# EasyEDA schematic BIT 5.json
TITLE: TRICORE | ALU | CMP; REV: 1.0; Date: 2022-01-05; Sheet: 3/8; Drawn By: Koehler, Paul; Company: komed3
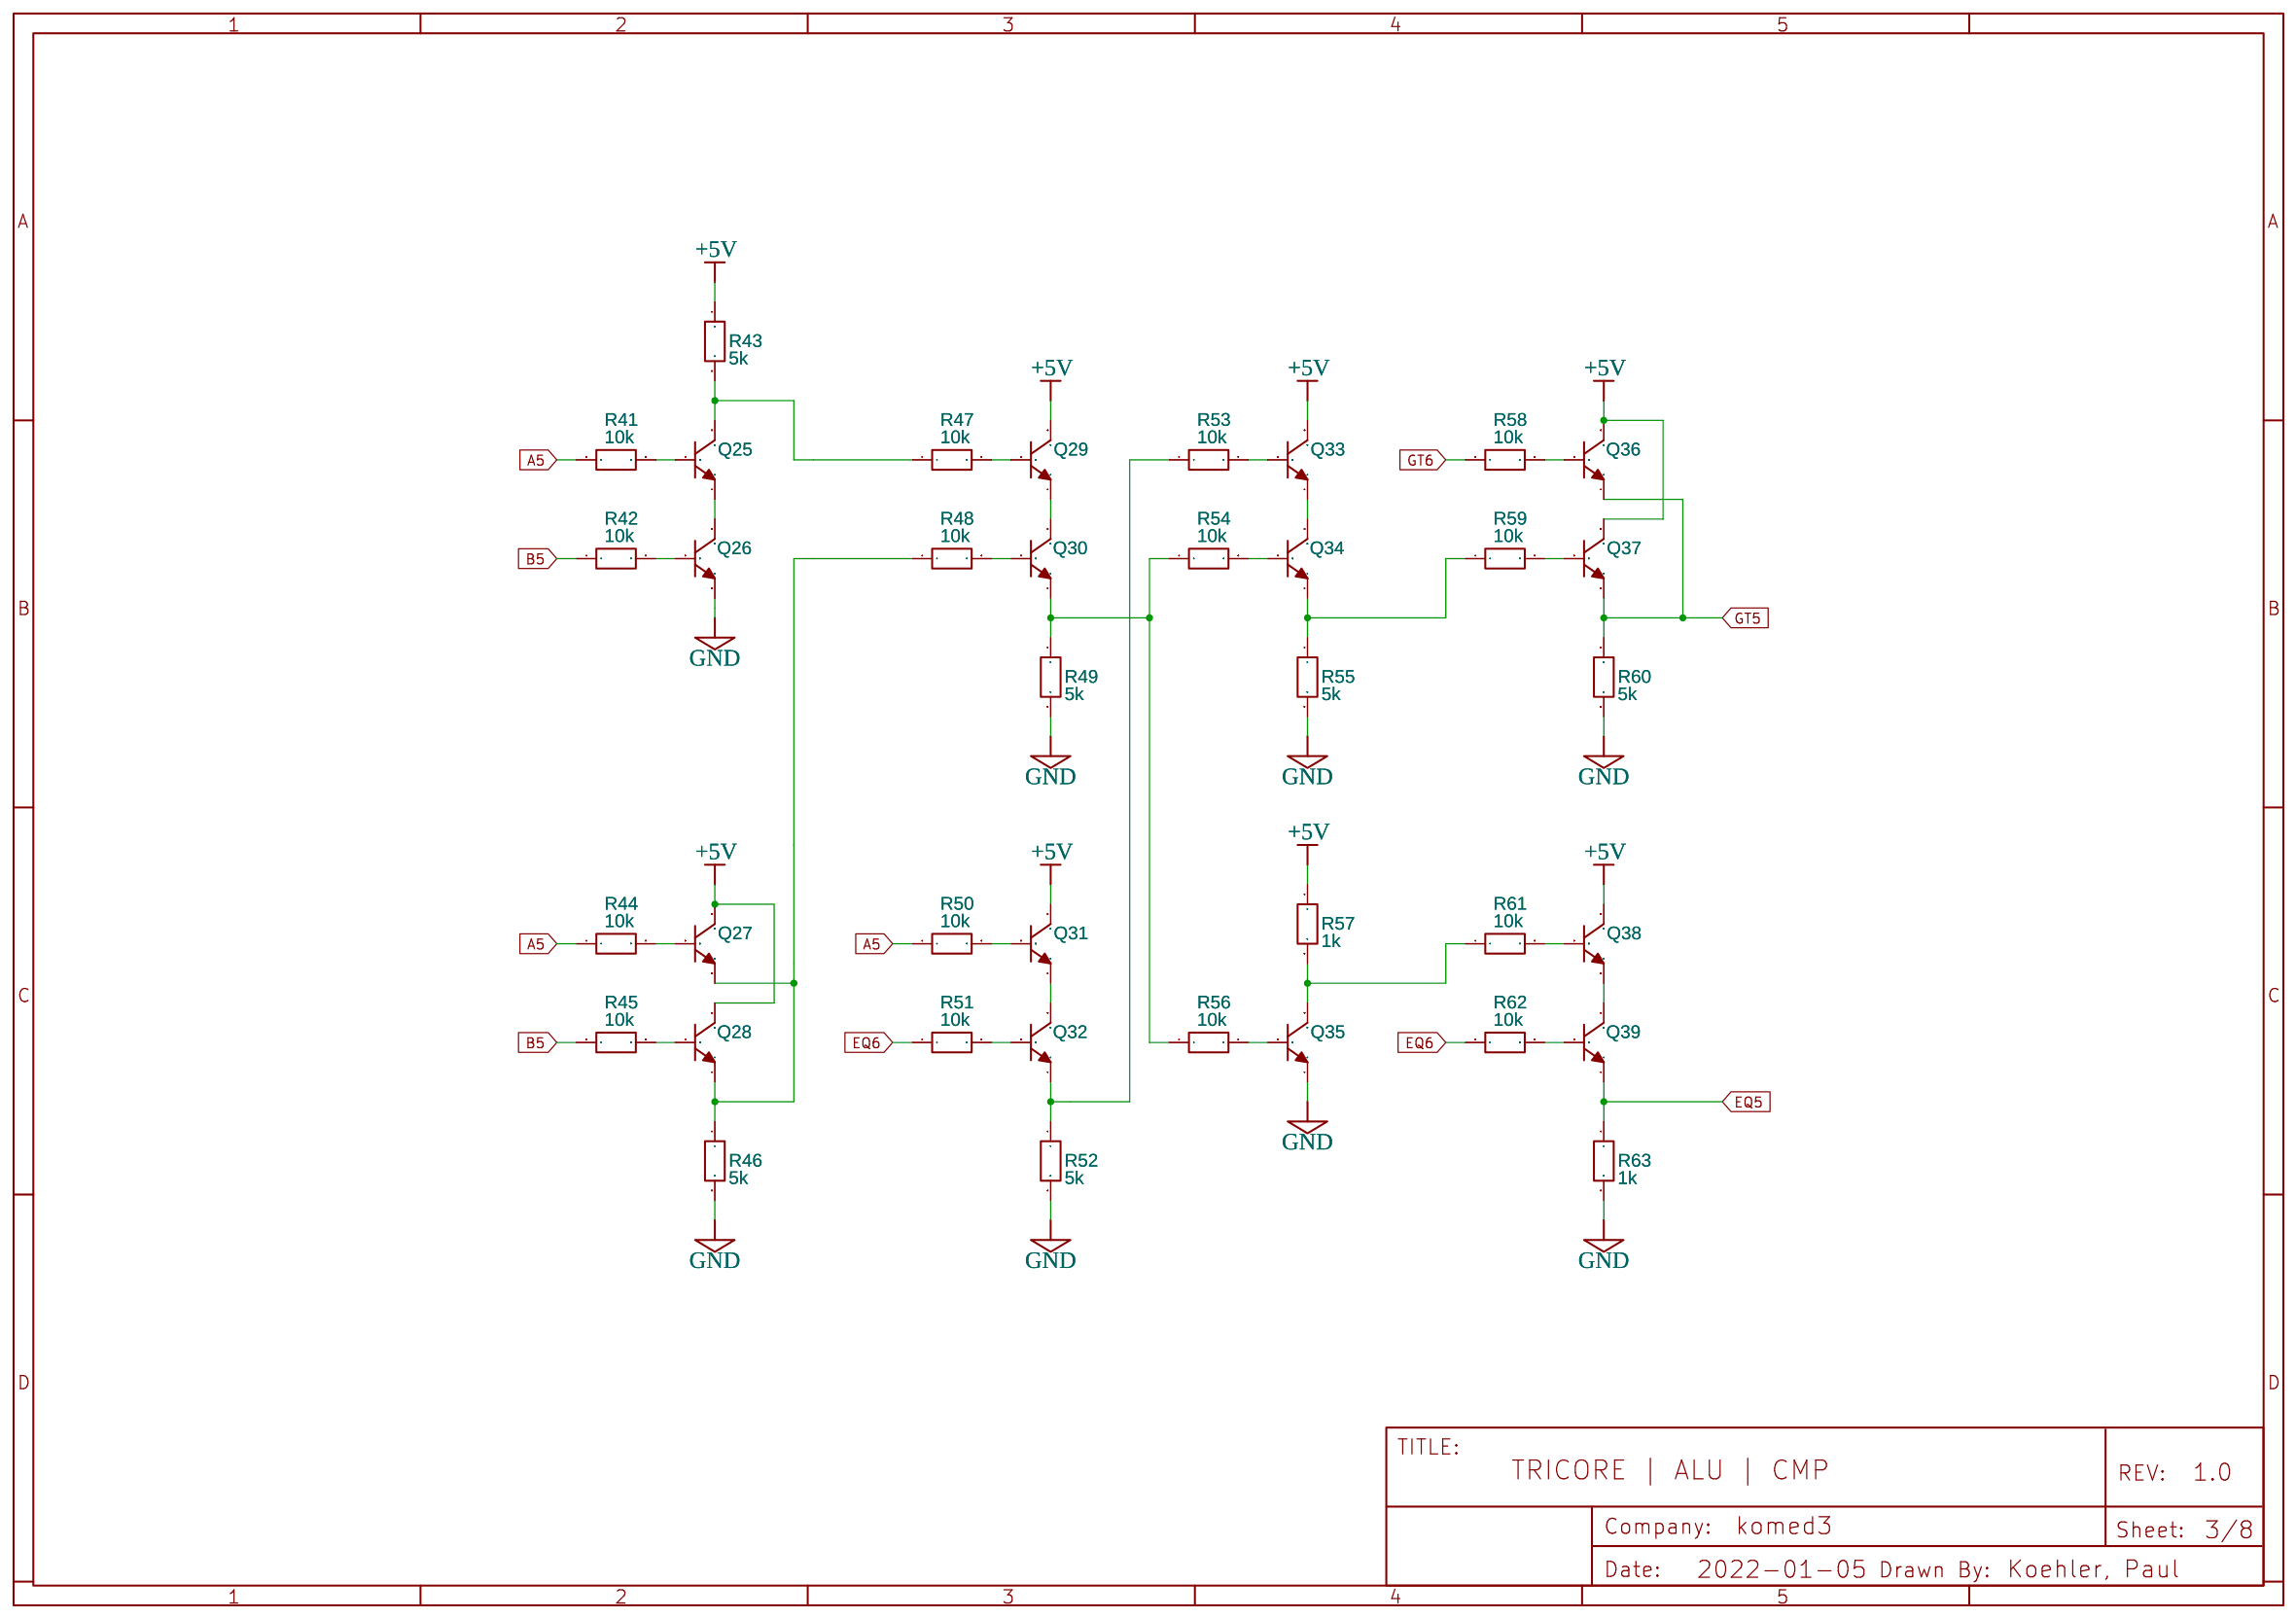
[diagram p0: schematic sheet]

## Parts
Q25  2N3904(TO-92)  [TO-92-3_L5.1-W4.1-P1.27-L]
Q26  2N3904(TO-92)  [TO-92-3_L5.1-W4.1-P1.27-L]
Q27  2N3904(TO-92)  [TO-92-3_L5.1-W4.1-P1.27-L]
Q28  2N3904(TO-92)  [TO-92-3_L5.1-W4.1-P1.27-L]
Q29  2N3904(TO-92)  [TO-92-3_L5.1-W4.1-P1.27-L]
Q30  2N3904(TO-92)  [TO-92-3_L5.1-W4.1-P1.27-L]
Q31  2N3904(TO-92)  [TO-92-3_L5.1-W4.1-P1.27-L]
Q32  2N3904(TO-92)  [TO-92-3_L5.1-W4.1-P1.27-L]
Q33  2N3904(TO-92)  [TO-92-3_L5.1-W4.1-P1.27-L]
Q34  2N3904(TO-92)  [TO-92-3_L5.1-W4.1-P1.27-L]
Q35  2N3904(TO-92)  [TO-92-3_L5.1-W4.1-P1.27-L]
Q36  2N3904(TO-92)  [TO-92-3_L5.1-W4.1-P1.27-L]
Q37  2N3904(TO-92)  [TO-92-3_L5.1-W4.1-P1.27-L]
Q38  2N3904(TO-92)  [TO-92-3_L5.1-W4.1-P1.27-L]
Q39  2N3904(TO-92)  [TO-92-3_L5.1-W4.1-P1.27-L]
R41  10k  [R_AXIAL-0.3]
R42  10k  [R_AXIAL-0.3]
R43  5k  [R_AXIAL-0.3]
R44  10k  [R_AXIAL-0.3]
R45  10k  [R_AXIAL-0.3]
R46  5k  [R_AXIAL-0.3]
R47  10k  [R_AXIAL-0.3]
R48  10k  [R_AXIAL-0.3]
R49  5k  [R_AXIAL-0.3]
R50  10k  [R_AXIAL-0.3]
R51  10k  [R_AXIAL-0.3]
R52  5k  [R_AXIAL-0.3]
R53  10k  [R_AXIAL-0.3]
R54  10k  [R_AXIAL-0.3]
R55  5k  [R_AXIAL-0.3]
R56  10k  [R_AXIAL-0.3]
R57  1k  [R_AXIAL-0.3]
R58  10k  [R_AXIAL-0.3]
R59  10k  [R_AXIAL-0.3]
R60  5k  [R_AXIAL-0.3]
R61  10k  [R_AXIAL-0.3]
R62  10k  [R_AXIAL-0.3]
R63  1k  [R_AXIAL-0.3]

## Library data of the parts
Q25-Q39 = 2N3904(TO-92): Supplier: LCSC; Manufacturer: SEMTECH; Manufacturer Part: 2N3904; Supplier Part: C118538; Contributor: LCEDA_Lib
R41-R63 = R_AXIAL-0.3_EU: Contributor: LCEDA_Lib

## Nets
+5V: Q27.3(C) Q28.3(C) Q29.3(C) Q31.3(C) Q33.3(C) Q36.3(C) Q37.3(C) Q38.3(C) R43.1 R57.1
GND: Q26.1(E) Q35.1(E) R46.2 R49.2 R52.2 R55.2 R60.2 R63.2
A5: R41.1 R44.1 R50.1
B5: R42.1 R45.1
EQ5: Q39.1(E) R63.1
EQ6: R51.1 R62.1
GT5: Q36.1(E) Q37.1(E) R60.1
GT6: R58.1
Net-(Q25-1): Q25.1(E) Q26.3(C)
Net-(Q25-2): Q25.2(B) R41.2
Net-(Q25-3): Q25.3(C) R43.2 R47.1
Net-(Q26-2): Q26.2(B) R42.2
Net-(Q27-1): Q27.1(E) Q28.1(E) R46.1 R48.1
Net-(Q27-2): Q27.2(B) R44.2
Net-(Q28-2): Q28.2(B) R45.2
Net-(Q29-1): Q29.1(E) Q30.3(C)
Net-(Q29-2): Q29.2(B) R47.2
Net-(Q30-1): Q30.1(E) R49.1 R54.1 R56.1
Net-(Q30-2): Q30.2(B) R48.2
Net-(Q31-1): Q31.1(E) Q32.3(C)
Net-(Q31-2): Q31.2(B) R50.2
Net-(Q32-1): Q32.1(E) R52.1 R53.1
Net-(Q32-2): Q32.2(B) R51.2
Net-(Q33-1): Q33.1(E) Q34.3(C)
Net-(Q33-2): Q33.2(B) R53.2
Net-(Q34-1): Q34.1(E) R55.1 R59.1
Net-(Q34-2): Q34.2(B) R54.2
Net-(Q35-2): Q35.2(B) R56.2
Net-(Q35-3): Q35.3(C) R57.2 R61.1
Net-(Q36-2): Q36.2(B) R58.2
Net-(Q37-2): Q37.2(B) R59.2
Net-(Q38-1): Q38.1(E) Q39.3(C)
Net-(Q38-2): Q38.2(B) R61.2
Net-(Q39-2): Q39.2(B) R62.2
